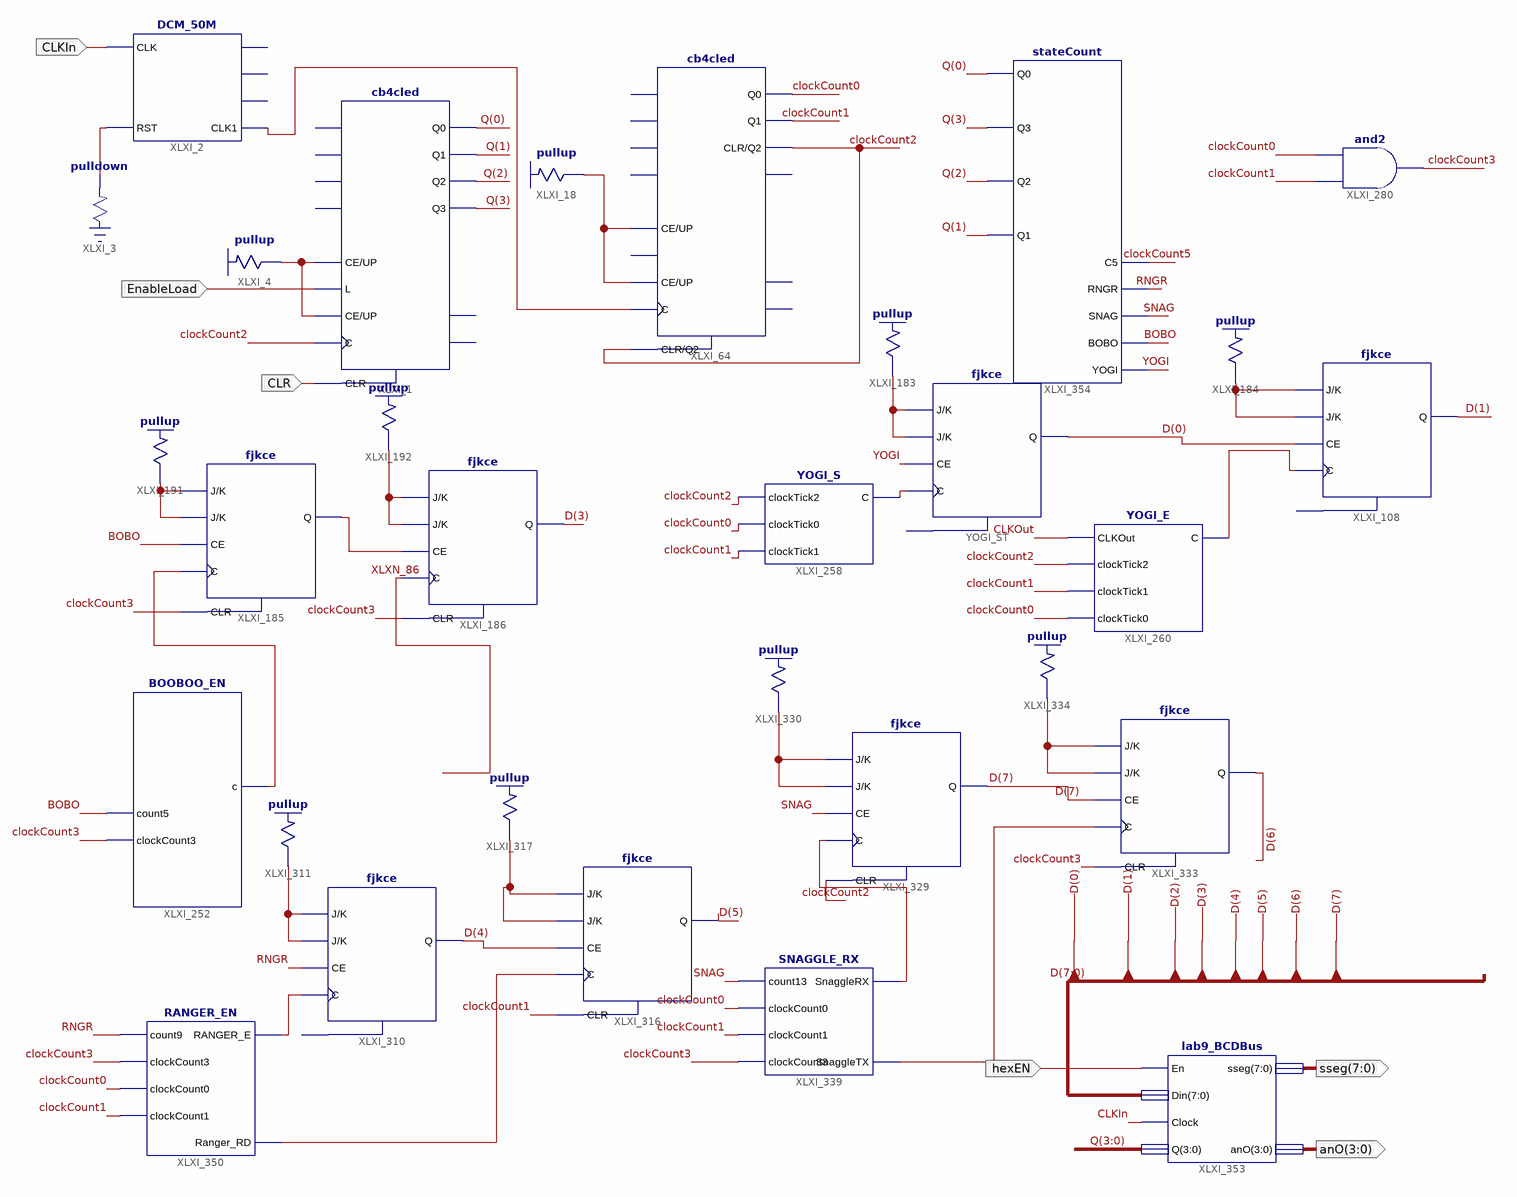
[diagram p0: schematic sheet 1]
// Xilinx ISE schematic lab9_experiment4.sch (spartan3e) as structural Verilog: 30 symbols, 6 ports
module lab9_experiment4 (
  input  CLKIn,
  input  CLR,
  input  EnableLoad,
  input  hexEN,
  output [7:0] sseg,
  output [3:0] anO
);

  wire BOBO, CLKOut, clockCount0, clockCount1, clockCount2, clockCount3, clockCount5, RNGR, SNAG, XLXN_4,
       XLXN_63, XLXN_86, XLXN_296, XLXN_327, XLXN_671, XLXN_673, XLXN_690, XLXN_842, XLXN_1014, XLXN_1015,
       XLXN_1073, XLXN_1122, XLXN_1129, XLXN_1171, XLXN_1173, XLXN_1180, XLXN_1190, XLXN_1260, XLXN_1261,
       YOGI;
  wire [3:0] Q;
  wire [7:0] D;

  \pulldown  XLXI_3 (.O(XLXN_4));
  cb4cled XLXI_64 (
    .C(XLXN_63), .CE(XLXN_327), .CLR(clockCount2), .UP(XLXN_327), .Q0(clockCount0), .Q1(clockCount1),
    .Q2(clockCount2));  // open: D0, D1, D2, D3, L, CEO, Q3, TC
  \pullup  XLXI_18 (.O(XLXN_327));
  \pullup  XLXI_191 (.O(XLXN_1014));
  cb4cled XLXI_1 (
    .C(clockCount2), .CE(XLXN_296), .CLR(CLR), .L(EnableLoad), .UP(XLXN_296), .Q0(Q[0]), .Q1(Q[1]),
    .Q2(Q[2]), .Q3(Q[3]));  // open: D0, D1, D2, D3, CEO, TC
  \pullup  XLXI_4 (.O(XLXN_296));
  fjkce XLXI_185 (.C(XLXN_1015), .CE(BOBO), .CLR(clockCount3), .J(XLXN_1014), .K(XLXN_1014), .Q(D[2]));
  \pullup  XLXI_192 (.O(XLXN_690));
  and XLXI_280 (clockCount3, clockCount1, clockCount0);
  fjkce XLXI_186 (.C(XLXN_86), .CE(D[2]), .CLR(clockCount3), .J(XLXN_690), .K(XLXN_690), .Q(D[3]));
  BOOBOO_EN XLXI_252 (.count5(BOBO), .clockCount3(clockCount3), .c(XLXN_1015));
  fjkce YOGI_ST (.C(XLXN_842), .CE(YOGI), .J(XLXN_671), .K(XLXN_671), .Q(D[0]));  // open: CLR
  \pullup  XLXI_184 (.O(XLXN_673));
  fjkce XLXI_108 (.C(XLXN_1073), .CE(D[0]), .J(XLXN_673), .K(XLXN_673), .Q(D[1]));  // open: CLR
  YOGI_S XLXI_258 (.clockTick2(clockCount2), .clockTick0(clockCount0), .clockTick1(clockCount1), .C(XLXN_842));
  YOGI_E XLXI_260 (
    .CLKOut(CLKOut), .clockTick2(clockCount2), .clockTick1(clockCount1), .clockTick0(clockCount0),
    .C(XLXN_1073));
  \pullup  XLXI_183 (.O(XLXN_671));
  fjkce XLXI_310 (.C(XLXN_1260), .CE(RNGR), .J(XLXN_1122), .K(XLXN_1122), .Q(D[4]));  // open: CLR
  \pullup  XLXI_311 (.O(XLXN_1122));
  \pullup  XLXI_317 (.O(XLXN_1129));
  fjkce XLXI_333 (.C(XLXN_1190), .CE(D[7]), .CLR(clockCount3), .J(XLXN_1173), .K(XLXN_1173), .Q(D[6]));
  \pullup  XLXI_334 (.O(XLXN_1173));
  \pullup  XLXI_330 (.O(XLXN_1171));
  fjkce XLXI_329 (.C(XLXN_1180), .CE(SNAG), .CLR(clockCount2), .J(XLXN_1171), .K(XLXN_1171), .Q(D[7]));
  SNAGGLE_RX XLXI_339 (
    .clockCount1(clockCount1), .clockCount0(clockCount0), .count13(SNAG), .clockCount3(clockCount3),
    .SnaggleTX(XLXN_1190), .SnaggleRX(XLXN_1180));
  fjkce XLXI_316 (.C(XLXN_1261), .CE(D[4]), .CLR(clockCount1), .J(XLXN_1129), .K(XLXN_1129), .Q(D[5]));
  RANGER_EN XLXI_350 (
    .count9(RNGR), .clockCount3(clockCount3), .clockCount0(clockCount0), .clockCount1(clockCount1),
    .RANGER_E(XLXN_1260), .Ranger_RD(XLXN_1261));
  lab9_BCDBus XLXI_353 (.En(hexEN), .Din(D), .Clock(CLKIn), .Q(Q), .sseg(sseg), .anO(anO));
  DCM_50M XLXI_2 (.CLK(CLKIn), .RST(XLXN_4), .CLK1(XLXN_63));  // open: CLK1M, CLK10k, CLK1k
  stateCount XLXI_354 (
    .Q0(Q[0]), .Q3(Q[3]), .Q2(Q[2]), .Q1(Q[1]), .C5(clockCount5), .RNGR(RNGR), .SNAG(SNAG), .BOBO(BOBO),
    .YOGI(YOGI));
endmodule
